# Altium schematic sheet LED_PCB.SchDoc
size A4; SheetNumber: 1; SheetTotal: 2
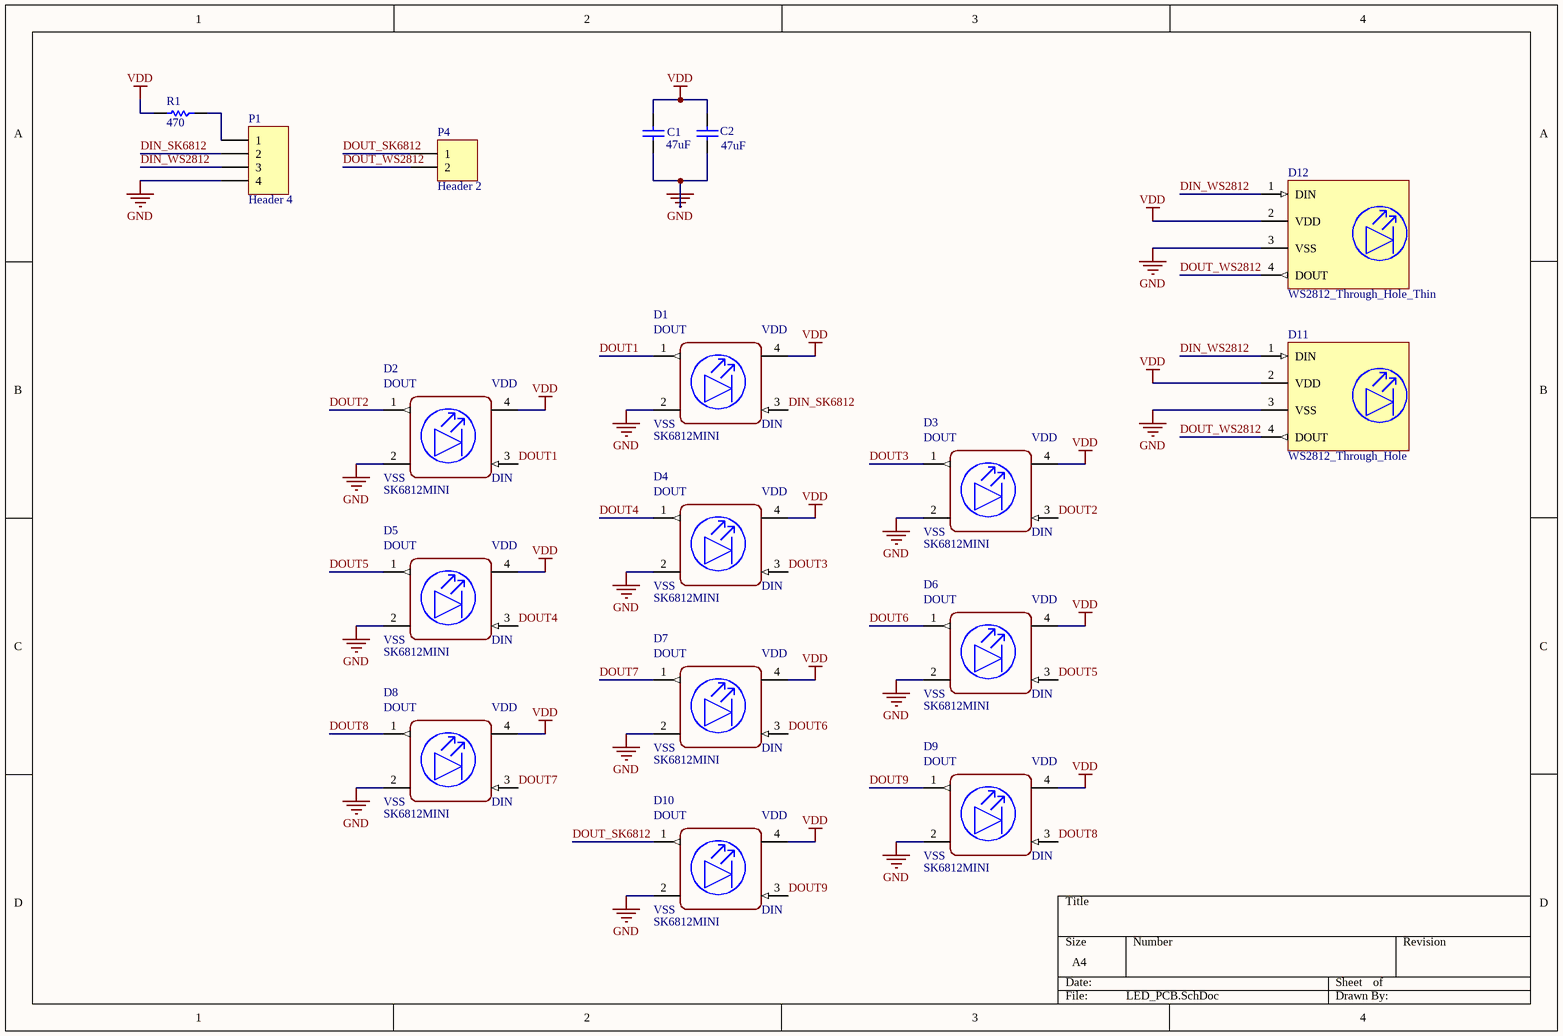
[diagram p0: LED_PCB.SchDoc]

## Parts
C1  47uF  [0805C]
C2  47uF  [0805C]
D1  Diode_SK6812MINI  [SK6812MINI]  (value not drawn)
D2  Diode_SK6812MINI  [SK6812MINI]  (value not drawn)
D3  Diode_SK6812MINI  [SK6812MINI]  (value not drawn)
D4  Diode_SK6812MINI  [SK6812MINI]  (value not drawn)
D5  Diode_SK6812MINI  [SK6812MINI]  (value not drawn)
D6  Diode_SK6812MINI  [SK6812MINI]  (value not drawn)
D7  Diode_SK6812MINI  [SK6812MINI]  (value not drawn)
D8  Diode_SK6812MINI  [SK6812MINI]  (value not drawn)
D9  Diode_SK6812MINI  [SK6812MINI]  (value not drawn)
D10  Diode_SK6812MINI  [SK6812MINI]  (value not drawn)
D11  WS2812_Through_Hole  [WS2812_Through_Hole]
D12  WS2812_Through_Hole_Thin  [WS2812_Through_Hole_smaller]
P1  Header 4  [HDR1X4]
P4  Header 2  [HDR1X2]
R1  470  [0805]

## Nets
GND: C1.2 C2.2 D1.2(VSS) D2.2(VSS) D3.2(VSS) D4.2(VSS) D5.2(VSS) D6.2(VSS) D7.2(VSS) D8.2(VSS) D9.2(VSS) D10.2(VSS) D11.3(VSS) D12.3(VSS) P1.4
VDD: C1.1 C2.1 D1.4(VDD) D2.4(VDD) D3.4(VDD) D4.4(VDD) D5.4(VDD) D6.4(VDD) D7.4(VDD) D8.4(VDD) D9.4(VDD) D10.4(VDD) D11.2(VDD) D12.2(VDD) R1.2
DIN_SK6812: D1.3(DIN) P1.2
DIN_WS2812: D11.1(DIN) D12.1(DIN) P1.3
DOUT1: D1.1(DOUT) D2.3(DIN)
DOUT2: D2.1(DOUT) D3.3(DIN)
DOUT3: D3.1(DOUT) D4.3(DIN)
DOUT4: D4.1(DOUT) D5.3(DIN)
DOUT5: D5.1(DOUT) D6.3(DIN)
DOUT6: D6.1(DOUT) D7.3(DIN)
DOUT7: D7.1(DOUT) D8.3(DIN)
DOUT8: D8.1(DOUT) D9.3(DIN)
DOUT9: D9.1(DOUT) D10.3(DIN)
DOUT_SK6812: D10.1(DOUT) P4.1
DOUT_WS2812: D11.4(DOUT) D12.4(DOUT) P4.2
NetP1_1: P1.1 R1.1

## Library data of the parts
C1 C2 = C: Capacitor; Reviewed by: RM - 2018/08/05; Revision: July-2002: Re-released for DXP Platform.; Supplier 1: *; Supplier Part Number 1: *; Value: 47uF
D1-D10 = Diode_SK6812MINI: SMD LED 3535; Manufacturer: Adafruit; helpURL: https://upverter.com/upn/revision/c89e73b2d25df682/; ComponentLink2Description: Datasheet; Temperature: -40°C to +85°C; Package: SMT_LED_5MM0; Supplier 2: Mouser; Supplier 1: Digi-Key; ComponentLink1URL: https://upverter.com/upn/revision/c89e73b2d25df682/; ComponentLink1Description: Upverter; ComponentLink2URL: https://cdn-shop.adafruit.com/product-files/1138/SK6812+LED+datasheet+.pdf; RoHS: TRUE; Temperature Range High: +85°C; Temperature Range Low: -40°C; Lead Free: yes; Ipc Land Pattern Name: SOIC320P540X160-4; Part Number: SK6812MINI
D12 = WS2812_Through_Hole_Thin: WS2812 Through Hole LED
P1 = Header 4: Header, 4-Pin; LatestRevisionDate: 17-Jul-2002; LatestRevisionNote: Re-released for DXP Platform.; Publisher: Altium Limited
P4 = Header 2: Header, 2-Pin; LatestRevisionDate: 17-Jul-2002; LatestRevisionNote: Re-released for DXP Platform.; Publisher: Altium Limited
R1 = R: Resistor; Reviewed by: RM - 2018/08/05; Supplier 1: *; Suppler Part Number 1: *; Value: 470